# EAGLE schematic Complete.weather.box.schematic.0 (EAGLE 7.5.0)
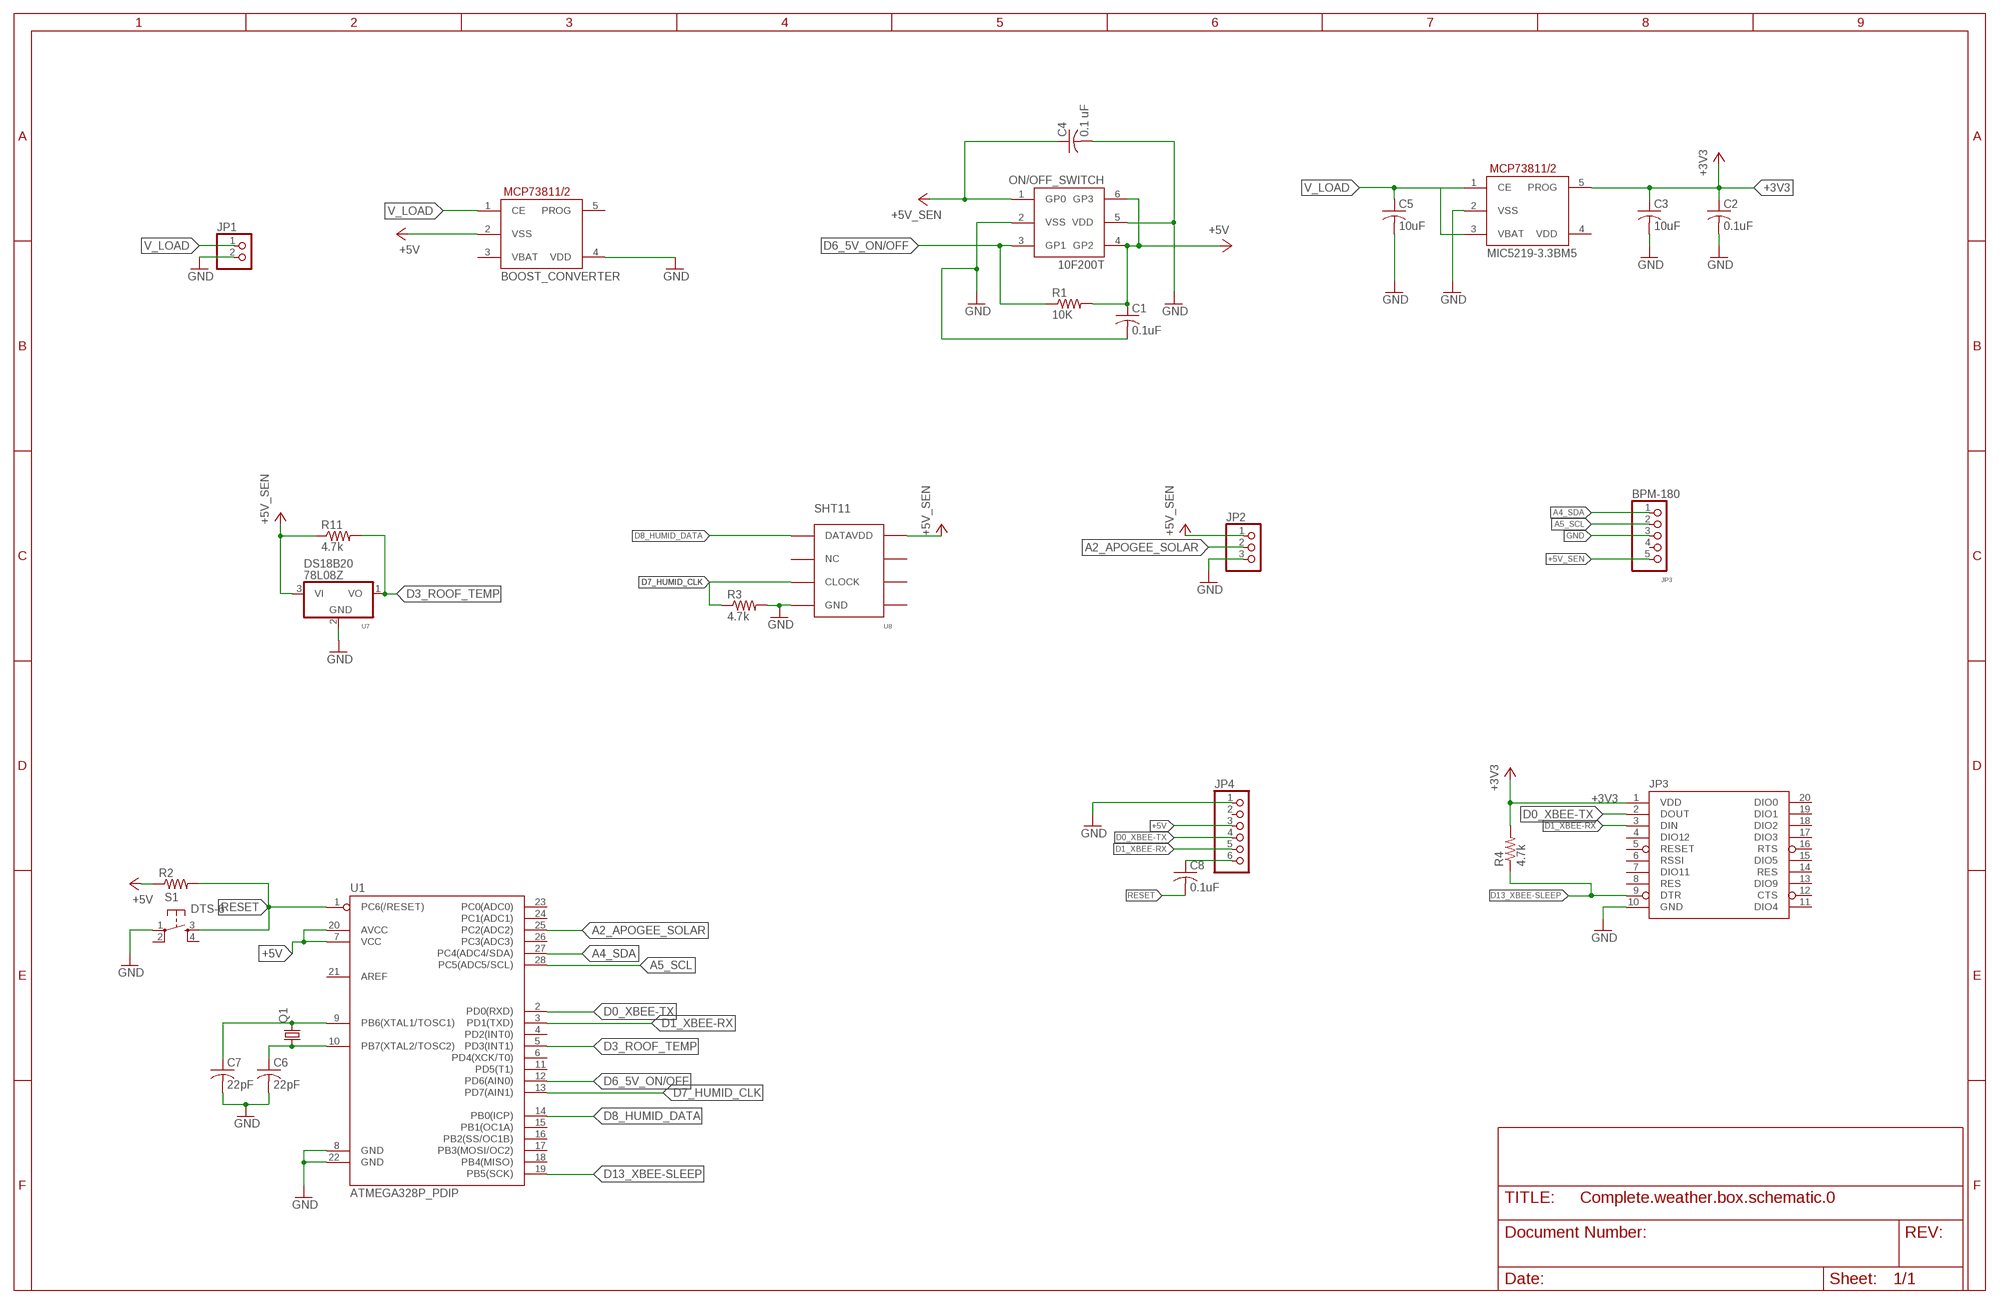
[diagram p0: schematic, sheet 1]

## Parts
BOOST_CONVERTER  MCP73811/2  [SOT23-5L]
BPM-180  HEADER-1X570MIL  [1X05_ROUND_70]
C1  0.1uF  C-USC0805  [C0805]
C2  0.1uF  C-USC0805  [C0805]
C3  10uF  C-USC0805  [C0805]
C4  0.1 uF  C-USC0805  [C0805]
C5  10uF  C-USC0805  [C0805]
C6  22pF  C-USC0805  [C0805]
C7  22pF  C-USC0805  [C0805]
C8  0.1uF  C-USC0805  [C0805]
DS18B20  78L08Z  [TO92]
JP1  PINHD-1X2  [1X02]
JP2  PINHD-1X3  [1X03]
JP3  XBEE-1B2  [XBEE-SILK]
JP4  PINHD-1X6  [1X06]
MIC5219-3.3BM5  MCP73811/2  [SOT23-5L]
ON/OFF_SWITCH  10F200T  [SOT23-6]
Q1  CRYSTALSM49  [SM49]
R1  10K  R-US_R0805  [R0805]
R2  R-US_R0805  [R0805]
R3  4.7k  R-US_R0805  [R0805]
R4  4.7k  R-US_R0805  [R0805]
R11  4.7k  R-US_R0805  [R0805]
S1  DTS-6  [DTS-6]
SP-215  U8  SHT11  [SHT11]
U1  ATMEGA328P_PDIP  [DIL28-3]

## Nets
+3V3: C2.1 C3.1 JP3.1(VDD) MIC5219-3.3BM5.5(PROG) R4.2
+5V: BOOST_CONVERTER.2(VSS) C1.1 C4.1 JP4.3 ON/OFF_SWITCH.1(GP0) ON/OFF_SWITCH.4(GP2) ON/OFF_SWITCH.6(GP3) R1.2 R2.1 U1.7(VCC) U1.20(AVCC) ; supply symbol labelled +5V_SEN
+5V_SEN: BPM-180.5 SP-215.VDD
A2_APOGEE_SOLAR: JP2.1 JP2.2 U1.25(PC2(ADC2)) ; supply symbol labelled +5V_SEN
A4_SDA: BPM-180.1 U1.27(PC4(ADC4/SDA))
A5_SCL: BPM-180.2 U1.28(PC5(ADC5/SCL))
D0_XBEE-TX: JP3.2(DOUT) JP4.4 U1.2(PD0(RXD))
D1_XBEE-RX: JP3.3(DIN) JP4.5 U1.3(PD1(TXD))
D3_ROOF_TEMP: DS18B20.1(VO) R11.2 U1.5(PD3(INT1))
D6_5V_ON/OFF: ON/OFF_SWITCH.3(GP1) R1.1 U1.12(PD6(AIN0))
D7_HUMID_CLK: R3.1 SP-215.7(CLOCK) U1.13(PD7(AIN1))
D8_HUMID_DATA: SP-215.CLOCK(DATA) U1.14(PB0(ICP))
D13_XBEE-SLEEP: JP3.9(DTR) R4.1 U1.19(PB5(SCK))
GND: BOOST_CONVERTER.4(VDD) BPM-180.3 C1.2 C2.2 C3.2 C4.2 C5.2 C6.2 C7.2 DS18B20.2(GND) JP1.2 JP2.3 JP3.10(GND) JP4.1 MIC5219-3.3BM5.2(VSS) ON/OFF_SWITCH.2(VSS) ON/OFF_SWITCH.5(VDD) R3.2 S1.1 SP-215.DATA(GND) U1.8(GND) U1.22(GND)
N$5: C8.1 JP4.6
N$12: C6.1 Q1.1 U1.10(PB7(XTAL2/TOSC2))
N$13: C7.1 Q1.2 U1.9(PB6(XTAL1/TOSC1))
RESET: C8.2 R2.2 S1.3 U1.1(PC6(/RESET))
V_LOAD: BOOST_CONVERTER.1(CE) C5.1 JP1.1 MIC5219-3.3BM5.1(CE) MIC5219-3.3BM5.3(VBAT)
VCC: DS18B20.3(VI) R11.1 ; supply symbol labelled +5V_SEN
Unconnected: BOOST_CONVERTER.3(VBAT) BOOST_CONVERTER.5(PROG) BPM-180.4 JP3.4(DIO12) JP3.5(RESET) JP3.6(RSSI) JP3.7(DIO11) JP3.8(RES) JP3.11(DIO4) JP3.12(CTS) JP3.13(DIO9) JP3.14(RES) JP3.15(DIO5) JP3.16(RTS) JP3.17(DIO3) JP3.18(DIO2) JP3.19(DIO1) JP3.20(DIO0) JP4.2 S1.2 S1.4 SP-215.2 SP-215.5 SP-215.6 SP-215.GND(NC) U1.4(PD2(INT0)) U1.6(PD4(XCK/T0)) U1.11(PD5(T1)) U1.15(PB1(OC1A)) U1.16(PB2(SS/OC1B)) U1.17(PB3(MOSI/OC2)) U1.18(PB4(MISO)) U1.21(AREF) U1.23(PC0(ADC0)) U1.24(PC1(ADC1)) U1.26(PC3(ADC3))

## Notes on the sheet
- SHT11
- JP3
- U7 | U8

## Power pins joined to a net without a drawn wire
VDD: MIC5219-3.3BM5.4(VDD)

## Library data of the parts
BOOST_CONVERTER MIC5219-3.3BM5 = adafruit:MCP73811/2: MCP73811 and MCP73812 Simple, Miniature Single-Cell, Fully Integrated Li-Ion / Li-Polymer Charge Management Controllers SOT-23-5 package, no indicator LED but with adjustable current, small and very inexpensive
BPM-180 = microbuilder:HEADER-1X5: PIN HEADER
C1-C8 = adafruit:C-US: CAPACITOR, American symbol
DS18B20 = adafruit:78*: Positive VOLTAGE REGULATOR Added bigger pads to the TO-92 package
JP1 = pinhead:PINHD-1X2: PIN HEADER
JP2 = adafruit:PINHD-1X3: PIN HEADER
JP3 = xbee1:XBEE-1: Xbee module footprints
JP4 = adafruit:PINHD-1X6: PIN HEADER
ON/OFF_SWITCH = adafruit:10F200T: PIC10F200/202/204/206 Ultra-small 8-bit PIC micros in SOT-23-6 and SOIC
Q1 = crystal:CRYSTAL: CRYSTAL; OC_FARNELL: unknown; OC_NEWARK: unknown
R1-R4 R11 = adafruit:R-US_: RESISTOR, American symbol
S1 = switch-tact:DTS-6
SP-215 = sht11:SHT11
U1 = sparkfun-digitalic:ATMEGA328P_PDIP: uC used in the Arduino 32kb flash, 1k EEPROM, 2k SRAM This is the through-hole version of this chip.